# EAGLE board dw08aRev3 (EAGLE 6.6.0), part 1 of 3
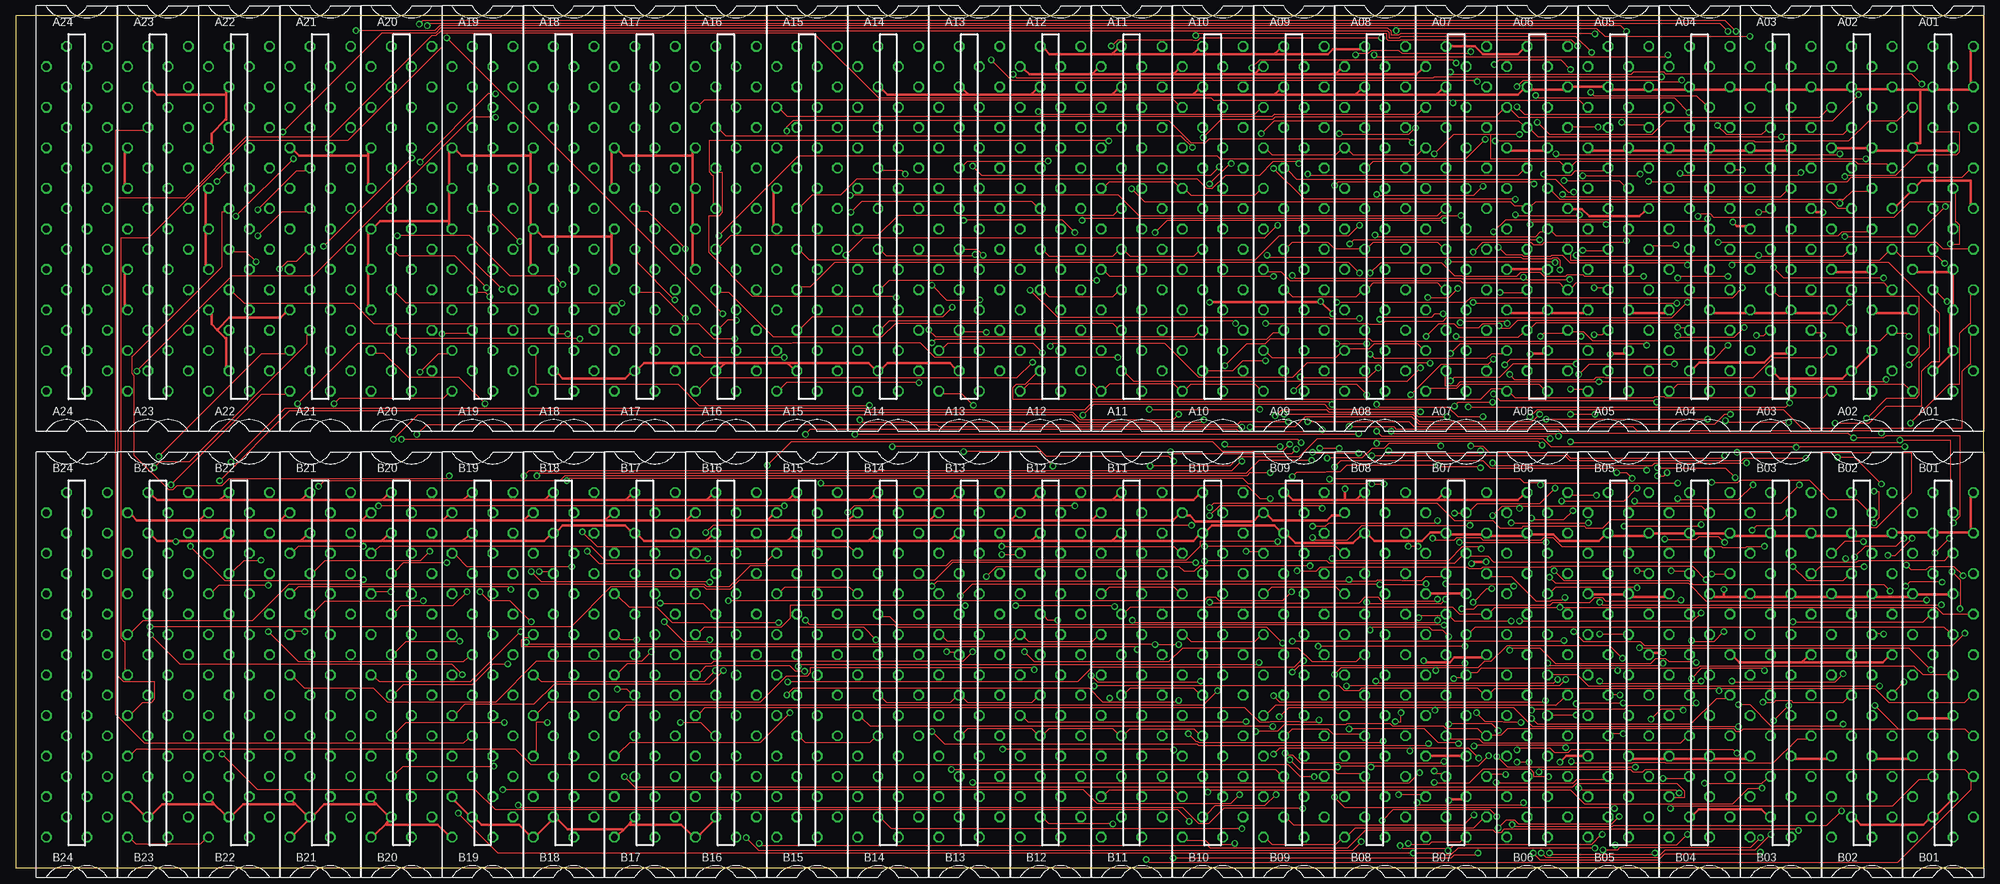
[diagram p6: board, top side]
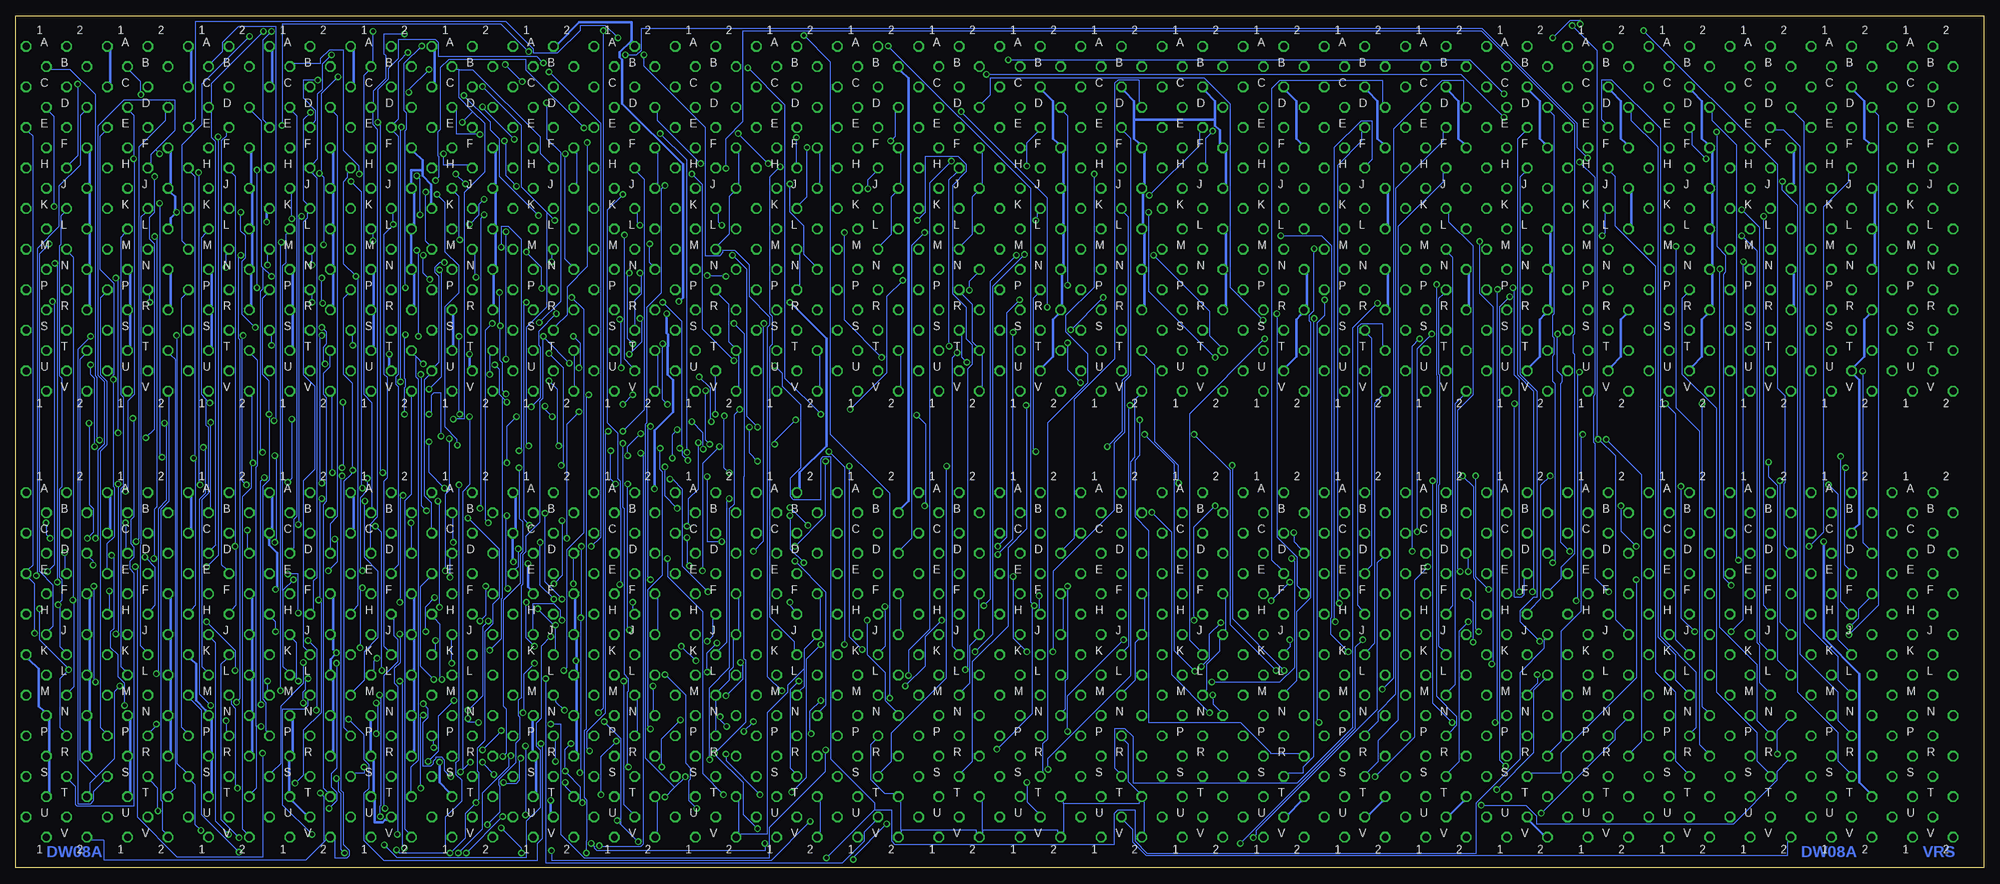
[diagram p7: board, bottom side, seen from below]

Size 307.98 x 133.35 mm. Coordinates in mm from the lower left corner, seen from the top.
Outline: 0,0 307.98,0 307.98,133.35 0,133.35 0,0
Copper layers (1*16): Top 0.035mm / dielectric 1.5mm / Bottom 0.035mm
Design rules "sierraproto": minimum track width 6mil, minimum drill 24mil, track to track 6mil, track to pad 6mil, pad to pad 10mil, via to via 6mil, smd to smd 6mil, copper to edge 25mil, drill to drill 10mil, minimum pad ring 10mil, minimum via ring 8mil, stop-mask expansion 0mil, vias tented up to drill 0mil, thermal gap 10mil
Net classes: 1 supply: width 0.381 mm

## Footprints (pad centres in the part's own frame; a part is rotated, then mirrored left to right if it is on the bottom)
H807 = drill 1.092 octagon: A1 4.763,28.575; A2 -1.587,28.575; B1 1.587,25.4; B2 -4.763,25.4; C1 4.763,22.225; C2 -1.587,22.225; D1 1.587,19.05; D2 -4.763,19.05; E1 4.763,15.875; E2 -1.587,15.875; F1 1.587,12.7; F2 -4.763,12.7; H1 4.763,9.525; H2 -1.587,9.525; J1 1.587,6.35; J2 -4.763,6.35; K1 4.763,3.175; K2 -1.587,3.175; L1 1.587,0; L2 -4.763,0; M1 4.763,-3.175; M2 -1.587,-3.175; N1 1.587,-6.35; N2 -4.763,-6.35; P1 4.763,-9.525; P2 -1.587,-9.525; R1 1.587,-12.7; R2 -4.763,-12.7; S1 4.763,-15.875; S2 -1.587,-15.875; T1 1.587,-19.05; T2 -4.763,-19.05; U1 4.763,-22.225; U2 -1.587,-22.225; V1 1.587,-25.4; V2 -4.763,-25.4

## Placement (x,y rotation side)
A01  M903  [H807]  301.62,100.01 0 top
A02  M903  [H807]  288.93,100.01 0 top
A03  M903  [H807]  276.23,100.01 0 top
A04  M903  [H807]  263.52,100.01 0 top
A05  M903  [H807]  250.82,100.01 0 top
A06  M907  [H807]  238.12,100.01 0 top
A07  M651  [H807]  225.43,100.01 0 top
A08  M651  [H807]  212.72,100.01 0 top
A09  M651  [H807]  200.03,100.01 0 top
A10  M651  [H807]  187.32,100.01 0 top
A11  M651  [H807]  174.62,100.01 0 top
A12  M651  [H807]  161.93,100.01 0 top
A13  W011  [H807]  149.22,100.01 0 top
A14  W011  [H807]  136.53,100.01 0 top
A15  W011  [H807]  123.83,100.01 0 top
A16  W011  [H807]  111.12,100.01 0 top
A17  W011  [H807]  98.42,100.01 0 top
A18  W011  [H807]  85.72,100.01 0 top
A19  W011  [H807]  73.03,100.01 0 top
A20  W011  [H807]  60.33,100.01 0 top
A21  W011  [H807]  47.62,100.01 0 top
A22  W011  [H807]  34.92,100.01 0 top
A23  W011  [H807]  22.23,100.01 0 top
A24  H807  [H807]  9.53,100.01 0 top
B01  M903  [H807]  301.62,30.16 0 top
B02  M903  [H807]  288.93,30.16 0 top
B03  M903  [H807]  276.23,30.16 0 top
B04  M903  [H807]  263.52,30.16 0 top
B05  M903  [H807]  250.82,30.16 0 top
B06  M101  [H807]  238.12,30.16 0 top
B07  M907  [H807]  225.43,30.16 0 top
B08  M651  [H807]  212.72,30.16 0 top
B09  M651  [H807]  200.03,30.16 0 top
B10  M651  [H807]  187.32,30.16 0 top
B11  M651  [H807]  174.62,30.16 0 top
B12  M651  [H807]  161.93,30.16 0 top
B13  M651  [H807]  149.22,30.16 0 top
B14  M651  [H807]  136.53,30.16 0 top
B15  M651  [H807]  123.83,30.16 0 top
B16  M517  [H807]  111.12,30.16 0 top
B17  M517  [H807]  98.42,30.16 0 top
B18  M517  [H807]  85.72,30.16 0 top
B19  M517  [H807]  73.03,30.16 0 top
B20  M517  [H807]  60.33,30.16 0 top
B21  M517  [H807]  47.62,30.16 0 top
B22  M517  [H807]  34.92,30.16 0 top
B23  M517  [H807]  22.23,30.16 0 top
B24  H807  [H807]  9.53,30.16 0 top

## Tracks (layer width: path | path; a pad name or v marks a point on that pad's centre or on a via)
!I_MB03  (via drill 0.61)
  Top 0.152: A08.H2 211.84,109.98 212.47,110.62 241.55,110.62 242.19,109.98 A06.H1 243.59,109.98 244.22,110.62 287.91,110.62 288.29,110.24 292.74,110.24 292.99,109.98 A02.H1 | v293.37,43.31 292.35,44.32 262.51,44.32 261.87,44.96 242.32,44.96 v240.79,46.48 | v240.16,67.18 239.78,67.56 213.74,67.56 v212.98,68.33
  Bottom 0.152: v293.37,43.31 293.37,40.39 B02.H1 | v240.79,46.48 240.79,58.42 240.16,59.05 v240.16,67.18 | v212.98,68.33 209.55,71.75 209.55,107.7 210.69,108.84 A08.H2
!I_MB04  (via drill 0.61)
  Top 0.152: v212.72,99.06 212.98,98.81 237.87,98.81 238.63,99.57 239.01,99.57 A06.L1 240.41,99.57 241.05,98.93 285.24,98.93 285.88,99.57 289.81,99.57 A02.L1
  Bottom 0.152: v212.72,99.06 212.72,79.63 211.58,78.49 A08.U2 | B02.L1 290.96,30.86 291.59,31.5 291.59,59.31 291.21,59.69 291.21,73.66 291.59,74.04 291.59,98.68 290.96,99.31 A02.L1
!I_MB05
  Top 0.152: A09.N2 195.96,93.34 197.99,93.34 199.39,91.95 226.06,91.95 226.44,91.57 241.55,91.57 242.19,90.93 A06.P1 243.59,90.93 244.22,91.57 292.35,91.57 292.99,90.93 A02.P1
  Bottom 0.152: B02.P1 294.13,21.34 294.77,21.97 294.77,65.15 293.75,66.17 293.75,76.2 294.77,77.22 294.77,89.15 294.13,89.79 A02.P1
!I_MB06  (via drill 0.61)
  Top 0.152: v185.8,114.3 188.72,117.22 196.72,117.22 197.1,117.6 231.65,117.6 232.66,118.62 A06.D2 234.06,118.62 235.2,117.47 282.32,117.47 283.46,118.62 A02.D2 | v289.18,51.05 286.26,51.05 284.86,49.66 B02.D2
  Bottom 0.152: v185.8,114.3 185.8,110.24 A10.H2 | v289.18,51.05 288.8,51.44 288.8,112.78 284.61,116.97 284.61,118.36 A02.D2
!I_MB07  (via drill 0.61)
  Top 0.152: v195.58,79.38 192.02,79.38 190.5,77.85 186.44,77.85 A10.U2 | v202.18,108.58 202.31,108.46 235.2,108.46 235.84,109.09 A06.H2 | v287.78,48.64 289.43,50.29 294.26,50.29 v295.53,51.56 | v241.05,111.76 241.17,111.63 285.37,111.63 v285.5,111.76
  Bottom 0.152: v195.58,79.38 200.53,84.33 200.53,106.93 v202.18,108.58 | v287.78,48.64 286.26,47.12 286.26,41.02 286.89,40.39 B02.H2 | v295.53,51.56 295.15,51.94 295.15,65.28 294.13,66.29 294.13,76.07 295.15,77.09 295.15,116.08 291.08,120.14 283.08,120.14 283.08,115.44 286.13,112.39 | 286.13,112.39 286.89,111.63 286.89,110.24 A02.H2 | v241.05,111.76 241.05,109.98 237.24,109.98 A06.H2 | v285.5,111.76 286.13,112.39
!I_MB08  (via drill 0.61)
  Top 0.152: v196.85,92.58 171.2,92.58 170.56,93.22 A11.N2 | v199.77,92.71 200.15,92.33 226.19,92.33 226.31,92.2 235.71,92.2 v235.97,92.46 236.35,92.2 236.47,92.08 v243.21,92.08 | v273.43,25.91 275.21,25.91 275.46,26.16 277.88,26.16 278.13,25.91 286,25.91 286.64,26.54 B02.M2 | A02.M2 286.64,96.39 286,95.76 272.92,95.76 v272.8,95.89 272.42,95.76 244.35,95.76 v244.22,95.89
  Bottom 0.152: v196.85,92.58 199.77,92.58 v199.77,92.71 | v235.97,92.46 236.09,92.58 236.09,96.14 A06.M2 | v273.43,25.91 272.92,26.42 272.92,82.68 273.18,82.93 273.18,95.5 v272.8,95.89 | v243.21,92.08 244.22,93.09 v244.22,95.89
!O_MB03  (via drill 0.61)
  Top 0.152: v200.79,110.24 200.41,110.62 196.85,110.62 194.69,108.46 189.36,108.46 187.2,106.3 186.44,106.3 184.91,107.82 131.57,107.82 129.03,105.28 124.59,105.28 122.94,103.63 A15.K2
  Bottom 0.152: v200.79,110.24 207.52,116.97 207.52,118.36 A08.D2
!O_MB04  (via drill 0.61)
  Top 0.152: v210.31,93.09 208.66,94.74 128.14,94.74 124.33,90.93 122.94,90.93 A15.P2
  Bottom 0.152: v210.31,93.09 210.06,92.84 210.06,89.92 211.07,88.9 211.07,84.84 A08.S2
!O_MB05  (via drill 0.61)
  Top 0.152: v129.92,95.89 132.59,98.55 195.45,98.55 v197.49,100.58
  Bottom 0.152: v129.92,95.89 121.16,87.12 121.16,83.31 119.51,81.66 A15.T2 | v197.49,100.58 197.99,101.09 197.99,102.49 A09.K2
!O_MB06
  Top 0.152: A16.D2 107.06,119.51 107.7,120.14 181.23,120.14 181.86,119.51 A10.D2
!O_MB07  (via drill 0.61)
  Top 0.152: v142.88,84.2 144.02,83.06 184.4,83.06 185.04,83.69 A10.S2 | v137.79,89.28 137.67,89.41 115.32,89.41 108.46,96.27 108.46,102.11 110.11,102.11 110.62,102.62 110.62,108.84 109.98,108.84 A16.H2
  Bottom 0.152: v142.88,84.2 v137.79,89.28
!O_MB08
  Top 0.152: A16.M2 110.24,97.28 111.89,98.93 134.87,98.93 138.05,102.11 171.7,102.11 172.34,102.74 A11.K2
-15V
  Top 0.381: 168.53,124.33 169.16,124.97 A11.B2 | 168.53,124.33 168.4,124.21 158.62,124.21 157.86,124.97 A12.B2 | 181.23,124.33 181.1,124.21 168.66,124.21 168.53,124.33 | 181.23,124.33 181.86,124.97 A10.B2 | 193.93,124.33 193.8,124.21 181.36,124.21 181.23,124.33 | 193.93,124.33 194.56,124.97 A09.B2 | 206.63,124.33 206.5,124.21 194.06,124.21 193.93,124.33 | 206.63,124.33 207.26,124.97 A08.B2 | A07.B2 219.96,124.97 219.2,124.21 206.76,124.21 206.63,124.33 | B08.B2 207.26,55.12 205.99,55.12 205.23,54.36 196.72,54.36 195.96,55.12 B09.B2 194.56,55.12 193.68,54.23 184.66,54.23 183.77,55.12 183.26,55.12 B10.B2 181.86,55.12 181.1,54.36 168.66,54.36 168.53,54.48 | 28.83,54.48 29.46,55.12 B22.B2 | 28.83,54.48 28.7,54.36 18.92,54.36 18.16,55.12 B23.B2 | 41.53,54.48 41.4,54.36 28.96,54.36 28.83,54.48 | 41.53,54.48 42.16,55.12 B21.B2 | 54.23,54.48 54.1,54.36 41.66,54.36 41.53,54.48 | 54.23,54.48 54.86,55.12 B20.B2 | 66.93,54.48 66.8,54.36 54.36,54.36 54.23,54.48 | 66.93,54.48 67.56,55.12 B19.B2 | 79.63,54.48 79.5,54.36 67.06,54.36 66.93,54.48 | 79.63,54.48 80.26,55.12 B18.B2 | 92.33,54.48 92.2,54.36 79.76,54.36 79.63,54.48 | 92.33,54.48 92.96,55.12 B17.B2 | 105.03,54.48 104.9,54.36 92.46,54.36 92.33,54.48 | 105.03,54.48 105.66,55.12 B16.B2 | 117.73,54.48 117.6,54.36 105.16,54.36 105.03,54.48 | 117.73,54.48 118.36,55.12 B15.B2 | 130.43,54.48 130.3,54.36 117.86,54.36 117.73,54.48 | 130.43,54.48 131.06,55.12 B14.B2 | 143.13,54.48 143,54.36 130.56,54.36 130.43,54.48 | 143.13,54.48 143.76,55.12 B13.B2 | 155.83,54.48 155.7,54.36 143.26,54.36 143.13,54.48 | 155.83,54.48 156.46,55.12 B12.B2 | 168.53,54.48 168.4,54.36 155.96,54.36 155.83,54.48
  Top 0.381: 168.53,54.48 169.16,55.12 B11.B2
  Bottom 0.381: A11.B2 169.42,124.71 168.28,123.57 168.28,57.4 169.42,56.26 B11.B2
A06U1  (via drill 0.61)
  Top 0.152: A10.M2 185.04,96.39 184.4,95.76 174.37,95.76 173.74,96.39 A11.M2 172.34,96.39 171.7,95.76 161.67,95.76 161.04,96.39 A12.M2 | A07.M2 223.14,97.28 222.5,97.92 212.47,97.92 211.84,97.28 A08.M2 210.44,96.9 206.38,96.9 205.36,97.92 199.77,97.92 199.14,97.28 A09.M2 | A09.J2 194.56,105.92 193.93,105.28 183.9,105.28 183.26,105.92 A10.J2 181.86,106.81 181.23,107.44 171.2,107.44 170.56,106.81 A11.J2 | A09.F2 195.96,112.27 196.6,111.63 206.63,111.63 207.26,112.27 A08.F2 208.66,112.27 209.3,111.63 219.33,111.63 219.96,112.27 A07.F2 | v240.92,94.74 240.79,94.87 v224.16,94.87
  Bottom 0.152: A12.M2 159.89,97.54 158.24,99.19 158.24,105.03 157.61,105.66 A12.J2 156.72,107.06 156.72,112.01 A12.F2 | A10.P2 185.29,91.19 185.29,96.14 A10.M2 | A11.M2 172.59,97.54 170.94,99.19 170.94,105.03 170.31,105.66 A11.J2 169.42,107.06 169.42,112.01 A11.F2 | B06.C1 242.95,53.09 242.95,57.15 244.09,58.29 244.09,76.33 243.33,77.09 A06.U1 242.44,78.49 241.81,79.12 241.81,92.58 242.44,93.22 242.44,93.98 241.68,94.74 v240.92,94.74 | A07.J2 220.22,107.06 220.22,112.01 A07.F2 | A08.J2 207.52,107.06 207.52,112.01 A08.F2 | A10.J2 182.12,107.06 182.12,112.01 A10.F2 | A09.M2 197.99,97.54 196.34,99.19 196.34,105.03 195.71,105.66 A09.J2 194.82,107.06 194.82,112.01 A09.F2 | v224.16,94.87 224.16,96.14 A07.M2
A06V1
  Top 0.152: A11.P2 172.34,90.04 171.7,89.41 161.67,89.41 161.04,90.04 A12.P2 | A12.V2 157.86,75.06 158.5,75.69 168.53,75.69 169.16,75.06 A11.V2 170.56,75.06 171.2,75.69 181.23,75.69 181.86,75.06 A10.V2 183.26,75.06 183.9,75.69 193.93,75.69 194.56,75.06 A09.V2 | A06.V1 239.01,75.06 238.38,75.69 226.19,75.69 225.55,75.06 221.36,75.06 A07.V2 | A09.P2 199.14,90.04 199.77,89.41 209.8,89.41 210.44,90.04 A08.P2 211.84,90.93 212.47,91.57 222.5,91.57 223.14,90.93 A07.P2 | A09.T2 195.96,80.52 196.6,79.88 206.63,79.88 207.26,80.52 A08.T2 208.66,81.28 211.84,81.28 212.6,82.04 219.33,82.04 219.96,81.41 A07.T2
  Bottom 0.152: A10.V2 182.12,75.31 182.12,80.26 A10.T2 | A11.V2 169.42,75.31 169.42,80.26 A11.T2 | A12.V2 156.72,75.31 156.72,80.26 A12.T2 157.61,81.66 158.24,82.3 158.24,88.14 159.89,89.79 A12.P2 | A07.V2 220.6,75.31 220.6,80.26 A07.T2 | A08.V2 207.52,75.31 207.52,80.26 A08.T2 | A09.V2 194.82,75.31 194.82,80.26 A09.T2 195.71,81.66 196.34,82.3 196.34,88.14 197.99,89.79 A09.P2
B07U1
  Top 0.152: B14.M2 135.64,26.54 136.27,25.91 146.3,25.91 146.94,26.54 B13.M2 148.34,26.54 148.97,25.91 159,25.91 159.64,26.54 B12.M2 | B15.F2 119.76,43.31 120.4,43.94 130.43,43.94 131.06,43.31 B14.F2 | B13.J2 145.16,36.07 145.8,35.43 155.83,35.43 156.46,36.07 B12.J2 157.86,36.07 158.5,35.43 168.53,35.43 169.16,36.07 B11.J2 | B07.U1 229.49,7.49 228.22,6.22 209.68,6.22 208.66,5.21 B08.V2 207.26,4.32 206.63,3.68 196.6,3.68 195.96,4.32 B09.V2 | B11.M2 173.74,27.43 174.37,28.07 184.4,28.07 185.04,27.43 B10.M2 | B08.P2 210.44,20.95 206.12,20.95 205.36,21.72 199.77,21.72 199.14,21.08 B09.P2 | B08.F2 207.26,43.31 206.63,43.94 196.6,43.94 195.96,43.31 B09.F2 | B10.J2 183.26,36.07 183.9,35.43 193.93,35.43 194.56,36.07 B09.J2 | B11.F2 170.56,43.31 171.2,43.94 181.23,43.94 181.86,43.31 B10.F2
  Bottom 0.152: B15.M2 121.79,27.69 121.54,27.94 121.54,31.88 119.51,33.91 119.51,35.81 B15.J2 118.62,37.21 118.62,42.16 B15.F2 | B14.M2 134.49,27.69 132.84,29.34 132.84,35.18 132.21,35.81 B14.J2 131.32,37.21 131.32,42.16 B14.F2 | B11.J2 169.42,37.21 169.42,42.16 B11.F2 | B13.J2 144.02,37.21 144.02,42.16 B13.F2 | B12.M2 159.89,27.69 158.62,28.96 158.62,34.8 157.61,35.81 B12.J2 157.23,37.21 157.23,42.16 B12.F2 | B09.T2 194.82,10.41 194.82,5.46 B09.V2 194.56,5.21 190.37,5.21 190.37,24.26 187.2,27.43 187.2,28.57 184.66,31.11 | B08.V2 207.52,5.46 207.52,10.41 B08.T2 | B10.F2 182.12,42.16 182.12,37.21 B10.J2 183.01,35.81 184.66,34.16 184.66,31.11 | 184.66,31.11 184.66,28.32 185.29,27.69 B10.M2 | B08.J2 207.52,37.21 207.52,42.16 B08.F2 | B08.P2 210.69,21.34 210.69,26.29 B08.M2 | B09.P2 198.5,21.34 198.5,26.29 B09.M2 197.99,27.69 196.34,29.34 196.34,30.73 195.71,31.37 195.71,35.81 B09.J2 194.82,37.21 194.82,42.16 B09.F2
B07V1  (via drill 0.61)
  Top 0.152: v217.93,3.81 218.06,3.68 221.23,3.68 221.62,4.06 226.06,4.06 226.31,4.32 B07.V1 | v190.75,3.81 190.63,3.68 186.82,3.68 186.18,4.32 183.26,4.32 B10.V2 | B13.P2 148.34,21.08 148.97,21.72 159,21.72 159.64,21.08 B12.P2 161.04,21.08 161.67,21.72 171.7,21.72 172.34,21.08 B11.P2 173.74,21.08 174.37,21.72 184.4,21.72 185.04,21.08 B10.P2 | B15.P2 122.94,20.19 123.57,19.56 133.6,19.56 134.24,20.19 B14.P2 | B10.T2 181.86,11.56 181.23,12.19 171.2,12.19 170.56,11.56 B11.T2
  Bottom 0.152: B10.V2 182.12,5.46 182.12,10.41 B10.T2 | v217.93,3.81 217.42,3.3 217.42,3.05 217.04,2.67 190.75,2.67 v190.75,3.81 | 169.42,5.84 169.42,10.41 B11.T2 170.56,11.56 171.96,11.56 174.12,13.72 174.12,19.3 173.48,19.94 B11.P2 | 169.42,5.84 169.42,5.46 B11.V2 | 156.72,5.84 156.72,10.41 B12.T2 | 156.72,5.84 156.72,5.46 B12.V2 157.61,5.46 157.61,5.84 169.42,5.84 | 144.02,10.03 144.02,10.41 B13.T2 | 144.02,10.03 144.02,5.46 B13.V2 144.91,5.46 144.91,5.84 156.72,5.84 | B14.V2 131.32,5.46 131.32,10.41 B14.T2 | B14.T2 132.21,11.81 133.86,13.46 133.86,19.3 134.49,19.94 B14.P2 | 144.02,10.03 132.21,10.03 132.21,10.41 B14.T2
GND  (via drill 0.61)
  Top 0.381: A23.N2 17.02,92.96 17.02,88.01 A23.R2 | A23.F2 17.02,112.01 17.02,107.06 A23.J2 | 31.5,84.2 30.61,85.09 30.61,86.61 A22.R2 | 31.5,84.2 32.77,82.93 32.89,82.93 32.89,78.49 A22.U2 | A22.N2 29.72,94.36 29.72,99.31 A22.L2 29.72,100.71 29.72,105.66 A22.J2 | 32.89,121.03 32.89,117.09 32.77,117.09 30.61,114.94 30.61,113.41 A22.F2 | 32.89,121.03 32.89,121.54 A22.C2 | A23.C2 21.34,121.79 22.1,121.03 32.77,121.03 32.89,121.03 | A20.R2 55.12,88.01 55.12,92.96 A20.N2 55.12,94.36 55.12,99.31 A20.L2 56.26,100.46 57.02,101.22 67.69,101.22 67.82,101.22 | 55.12,111.51 55.12,107.06 A20.J2 | 55.12,111.51 55.12,112.01 A20.F2 | A21.F2 43.56,112.27 44.32,111.51 54.99,111.51 55.12,111.51 | 31.5,84.2 31.62,84.33 33.4,86.11 41.4,86.11 42.16,86.87 A21.R2 | 67.82,101.22 67.82,100.71 A19.L2 | 67.82,101.22 67.82,105.66 A19.J2 67.82,107.06 67.82,112.01 A19.F2 68.96,112.27 69.72,111.51 80.39,111.51 80.52,111.51 | A18.L2 80.52,99.31 80.52,94.36 A18.N2 | A18.L2 80.52,100.71 80.52,105.66 A18.J2 80.52,107.06 80.52,111.51 | 80.52,111.51 80.52,112.01 A18.F2 | 93.22,98.81 93.22,94.36 A17.N2 | 93.22,98.81 93.22,99.31 A17.L2 | A17.J2 93.22,107.06 93.22,112.01 A17.F2 94.36,112.27 95.12,111.51 105.79,111.51 105.92,111.51 | A18.L2 81.66,99.57 82.42,98.81 93.09,98.81 93.22,98.81 | A18.U2 84.84,77.34 85.6,76.58 95.38,76.58 96.14,77.34 A17.U2 97.54,78.23 98.3,78.99 110.74,78.99 110.87,78.87 | 120.9,78.87 120.78,78.99 111,78.99 110.87,78.87 | 120.9,78.87 121.54,78.23 A15.U2 | 110.87,78.87 110.24,78.23 A16.U2 | A16.N2 105.92,94.36 105.92,99.31 A16.L2 105.92,100.71 105.92,105.66 A16.J2 105.92,107.06 105.92,111.51
  Top 0.381: 105.92,111.51 105.92,112.01 A16.F2 | 120.9,78.87 121.03,78.99 133.48,78.99 134.24,78.23 A14.U2 135.64,78.23 136.4,78.99 146.18,78.99 146.94,78.23 A13.U2 | 298.07,121.79 299.34,121.79 A01.C2 300.74,121.79 305.69,121.79 A01.C1 305.94,122.94 305.94,127.89 A01.A1 | 298.07,121.79 294.39,121.79 A02.C1 292.99,121.92 288.04,121.92 A02.C2 286.64,121.79 281.69,121.79 A03.C1 280.29,121.79 275.34,121.79 A03.C2 273.94,121.79 268.99,121.79 A04.C1 267.59,121.79 262.64,121.79 A04.C2 261.24,121.79 256.29,121.79 A05.C1 254.89,121.79 249.94,121.79 A05.C2 248.54,122.3 243.59,122.3 A06.C1 242.19,121.79 237.24,121.79 A06.C2 235.84,121.79 235.08,121.03 222.63,121.03 222.5,121.16 | A05.K1 254.89,102.74 254.13,101.98 246.25,101.98 245.11,103.12 243.59,103.12 A06.K1 | A05.F2 246.76,112.27 251.71,112.27 A05.F1 253.11,112.27 258.06,112.27 A04.F2 259.46,112.27 264.41,112.27 A04.F1 265.81,112.27 270.76,112.27 A03.F2 272.16,112.27 277.11,112.27 A03.F1 | v236.98,80.39 237.11,80.52 239.01,80.52 A06.T1 | A06.R2 234.06,86.87 239.01,86.87 A06.R1 240.41,86.87 245.36,86.87 A05.R2 | A06.N1 239.01,93.73 234.06,93.73 A06.N2 | A06.F1 239.01,112.27 234.06,112.27 A06.F2 | v249.56,80.39 249.68,80.52 251.71,80.52 A05.T1 | A04.R2 258.06,86.87 253.11,86.87 A05.R1 | A04.R1 265.81,86.87 270.76,86.87 A03.R2 272.16,86.87 277.11,86.87 A03.R1 278.51,86.87 283.46,86.87 A02.R2 | v268.73,101.09 269.37,100.46 270.76,100.46 A03.L2 | A04.U2 262.64,78.23 263.52,79.12 273.69,79.12 275.08,80.52 277.11,80.52 A03.T1 | A01.F2 296.16,112.27 291.21,112.27 A02.F1 289.81,112.65 284.86,112.65 A02.F2
  Top 0.381: A01.F1 302.51,112.27 297.56,112.27 A01.F2 | v282.83,102.62 281.81,102.62 281.69,102.74 A03.K1 | A01.U2 300.74,78.23 302.77,80.26 A01.T1 302.77,81.66 302.77,86.61 A01.R1 303.15,88.01 303.15,92.96 A01.N1 302.51,93.22 297.56,93.22 A01.N2 | A02.K1 294.39,103.63 296.42,105.66 A01.J2 297.56,106.81 298.32,107.57 305.94,107.57 305.94,103.89 A01.K1 | A03.U2 275.34,77.34 276.1,76.58 285.88,76.58 286.64,77.34 A02.U2 288.04,78.23 290.07,80.26 A02.T1 | A01.R2 296.16,86.87 291.21,86.87 A02.R1 | A02.N2 284.86,93.22 289.81,93.22 A02.N1 | 298.07,121.79 298.07,121.67 298.07,113.41 297.31,113.41 A01.F2 | A15.J2 118.62,105.66 118.62,100.71 A15.L2 | 159,121.16 158.88,121.03 149.1,121.03 148.97,121.16 | 159,121.16 159.64,121.79 A12.C2 | 148.97,121.16 148.34,121.79 A13.C2 | 171.7,121.16 171.58,121.03 159.13,121.03 159,121.16 | 171.7,121.16 172.34,121.79 A11.C2 | 184.4,121.16 184.28,121.03 171.83,121.03 171.7,121.16 | 184.4,121.16 185.04,121.79 A10.C2 | 197.1,121.16 196.98,121.03 184.53,121.03 184.4,121.16 | 197.1,121.16 197.74,121.79 A09.C2 | 209.8,121.16 209.68,121.03 197.23,121.03 197.1,121.16 | 209.8,121.16 210.44,121.79 A08.C2 | 222.5,121.16 222.38,121.03 209.93,121.03 209.8,121.16 | 222.5,121.16 223.14,121.79 A07.C2 | A14.C2 135.64,121.79 136.4,121.03 148.84,121.03 148.97,121.16 | B02.U2 288.04,7.49 288.8,6.73 298.58,6.73 299.34,7.49 B01.U2 300.74,8.38 302.77,10.41 B01.T1 | B01.R2 296.16,17.02 291.21,17.02 B02.R1 | B01.F1 302.51,42.8 297.56,42.8 B01.F2 296.16,42.42 291.21,42.42 B02.F1 289.81,42.42 284.86,42.42 B02.F2 283.46,42.42 278.51,42.42 B03.F1 277.11,42.42 272.16,42.42 B03.F2 270.76,42.42 267.33,42.42
  Top 0.381: B01.N1 302.51,23.37 297.56,23.37 B01.N2 | v257.81,33.66 256.29,33.66 B05.K1 | B05.R1 253.11,17.02 258.06,17.02 B04.R2 259.46,17.02 264.41,17.02 B04.R1 265.81,17.02 270.76,17.02 B03.R2 | B04.F2 258.06,42.42 253.11,42.42 B05.F1 251.71,42.8 246.76,42.8 B05.F2 | v241.68,16.51 242.7,17.53 245.36,17.53 B05.R2 | B03.U2 273.94,8.38 273.18,9.14 263.4,9.14 262.64,8.38 B04.U2 | 279.65,32.26 280.29,32.89 B03.K1 | 279.65,32.26 279.53,32.13 269.75,32.13 268.99,32.89 B04.K1 | B02.K1 292.99,32.89 292.23,32.13 279.78,32.13 279.65,32.26 | 267.33,42.42 265.81,42.42 B04.F1 | B02.R2 283.46,17.02 278.51,17.02 B03.R1 | B16.U2 109.09,7.24 107.06,5.21 B16.V2 105.66,5.21 104.14,6.73 96.14,6.73 96.01,6.86 | 96.01,6.86 96.39,7.24 B17.U2 | 95,5.84 96.01,6.86 | 95,5.84 94.36,5.21 B17.V2 | 95,5.84 94.87,5.97 86.36,5.97 84.84,7.49 B18.U2 83.69,7.24 81.66,5.21 B18.V2 80.26,5.21 78.74,6.73 72.9,6.73 72.14,7.49 B19.U2 70.74,8.38 68.71,10.41 B19.T2 | B23.T2 17.91,10.41 19.94,8.38 B23.U2 21.34,8.38 22.86,9.91 30.86,9.91 30.99,10.03 | 30.99,10.03 32.64,8.38 B22.U2 34.04,8.38 35.56,9.91 43.56,9.91 43.69,10.03 | 30.99,10.03 30.61,10.41 B22.T2 | B21.V2 43.56,5.21 45.59,7.24 B21.U2 | 43.69,10.03 45.34,8.38 B21.U2 | 43.69,10.03 43.31,10.41 B21.T2 | 57.91,6.86 58.29,7.24 B20.U2 58.04,8.38 56.39,10.03 | 57.91,6.86 56.26,5.21 B20.V2 | 56.39,10.03 56.01,10.41 B20.T2 | B21.U2 46.74,8.38 48.26,9.91 56.26,9.91 56.39,10.03 | B19.V2 67.56,5.21 66.04,6.73 58.04,6.73 57.91,6.86 | B01.A1 305.94,58.04 305.94,53.09 B01.C1 305.69,52.45 300.74,52.45 B01.C2 299.34,52.45 294.39,52.45 B02.C1 292.99,51.94 288.04,51.94 B02.C2 286.64,51.94 281.69,51.94 B03.C1 280.29,51.94 275.34,51.94 B03.C2 273.94,51.94 268.99,51.94 B04.C1 267.59,52.32 262.64,52.32 B04.C2 261.24,52.32 256.29,52.32 B05.C1 254.89,51.94 249.94,51.94 B05.C2 248.54,51.94 247.78,51.18 241.68,51.18 240.66,52.2 237.24,52.2 B06.C2 235.84,51.94 230.89,51.94 B07.C1 229.49,52.2 224.54,52.2 B07.C2 223.14,52.45 221.36,52.45 220.09,51.18 212.6,51.18 211.84,51.94 B08.C2 210.44,51.94 209.3,50.8 200.28,50.8 199.14,51.94 B09.C2 197.74,52.83 196.98,53.59 187.2,53.59 186.44,52.83 B10.C2 185.04,51.94 184.28,51.18 171.83,51.18 171.7,51.31
  Top 0.381: 25.02,51.18 31.88,51.18 32,51.31 | 25.02,51.18 22.1,51.18 21.34,51.94 B23.C2 | 32,51.31 32.64,51.94 B22.C2 | 44.7,51.31 44.58,51.18 32.13,51.18 32,51.31 | 44.7,51.31 45.34,51.94 B21.C2 | 57.4,51.31 57.28,51.18 44.83,51.18 44.7,51.31 | 57.4,51.31 58.04,51.94 B20.C2 | 70.1,51.31 69.98,51.18 57.53,51.18 57.4,51.31 | 70.1,51.31 70.74,51.94 B19.C2 | 70.1,51.31 70.23,51.18 82.68,51.18 83.44,51.94 B18.C2 84.84,52.83 85.6,53.59 95.38,53.59 96.14,52.83 B17.C2 97.54,51.94 98.3,51.18 108.08,51.18 108.2,51.31 | v224.28,10.54 224.41,10.67 226.31,10.67 B07.T1 | B07.R2 221.36,17.53 226.31,17.53 B07.R1 | B07.F1 226.31,42.93 221.36,42.93 B07.F2 | v220.34,32.38 220.6,32.13 224.41,32.13 225.17,32.89 229.49,32.89 B07.K1 | 108.2,51.31 108.84,51.94 B16.C2 | 120.9,51.31 120.78,51.18 108.33,51.18 108.2,51.31 | 120.9,51.31 121.54,51.94 B15.C2 | 133.6,51.31 133.48,51.18 121.03,51.18 120.9,51.31 | 133.6,51.31 134.24,51.94 B14.C2 | 146.3,51.31 146.18,51.18 133.73,51.18 133.6,51.31 | 146.3,51.31 146.94,51.94 B13.C2 | 159,51.31 158.88,51.18 146.43,51.18 146.3,51.31 | 159,51.31 159.64,51.94 B12.C2 | 171.7,51.31 171.58,51.18 159.13,51.18 159,51.31 | 171.7,51.31 172.34,51.94 B11.C2 | v227.84,47.62 228.09,47.88 v230.12,47.88 | 25.02,51.18 v25.02,51.05 | v267.33,43.56 267.33,42.55 267.33,42.42
  Bottom 0.381: A23.R2 17.91,86.61 18.67,85.85 18.67,80.01 20.19,78.49 A23.U2 20.19,77.09 19.43,76.33 19.43,53.85 20.19,53.09 B23.C2 | A23.N2 17.02,94.36 17.02,99.31 A23.L2 17.02,100.71 17.02,105.66 A23.J2 | A23.C2 20.19,121.54 18.67,120.02 18.67,114.17 17.91,113.41 A23.F2 | A22.N2 29.72,92.96 29.72,88.01 A22.R2 | A22.F2 29.72,112.01 29.72,107.06 A22.J2 | A21.U2 45.59,78.49 44.07,80.01 44.07,85.85 43.31,86.61 A21.R2 42.42,88.01 42.42,92.96 A21.N2 42.42,94.36 42.42,99.31 A21.L2 42.42,100.71 42.42,105.66 A21.J2 42.42,107.06 42.42,112.01 A21.F2 43.31,113.41 44.07,114.17 44.07,120.02 45.59,121.54 A21.C2 | A20.U2 58.29,78.49 56.77,80.01 56.77,85.85 56.01,86.61 A20.R2 | A20.J2 55.12,105.66 55.12,100.71 A20.L2 | A20.C2 58.29,121.54 56.77,120.02 56.77,114.17 56.01,113.41 A20.F2 | A19.U2 70.99,78.49 69.47,80.01 69.47,85.85 68.71,86.61 A19.R2 67.82,88.01 67.82,92.96 A19.N2 67.82,94.36 67.82,99.31 A19.L2 | A19.C2 70.99,121.54 69.47,120.02 69.47,114.17 68.71,113.41 A19.F2 | A18.R2 80.52,88.01 80.52,92.96 A18.N2 | A18.C2 83.69,121.54 82.17,120.02 82.17,114.17 81.41,113.41 A18.F2 | A17.R2 93.22,88.01 93.22,92.96 A17.N2 | A17.J2 93.22,105.66 93.22,100.71 A17.L2 | A17.C2 96.39,121.54 94.87,120.02 94.87,114.17 94.11,113.41 A17.F2 | A16.N2 105.92,92.96 105.92,88.01 A16.R2 106.81,86.61 107.57,85.85 107.57,80.01 109.09,78.49 A16.U2 | A16.C2 109.09,121.54 107.57,120.02 107.57,114.17 106.81,113.41 A16.F2 | A02.A1 293.24,127.89 293.24,122.94 A02.C1 | A06.A1 242.44,127.89 242.44,122.94 A06.C1 | A05.A1 255.14,127.89 255.14,122.94 A05.C1 | A04.A1 267.84,127.89 267.84,122.94 A04.C1
  Bottom 0.381: A03.A1 280.54,127.89 280.54,122.94 A03.C1 | 244.35,109.22 244.35,110.74 245.62,112.01 A05.F2 | 244.35,109.22 244.35,108.33 242.95,106.93 242.95,103.89 A06.K1 | v236.98,80.39 236.98,78.49 A06.U2 | A06.R2 233.17,88.01 233.17,92.96 A06.N2 232.92,94.36 232.92,99.31 A06.L2 232.92,100.71 232.92,105.66 A06.J2 232.92,107.06 232.92,112.01 A06.F2 | A05.R2 245.62,88.01 245.62,92.96 A05.N2 246.13,94.36 246.13,99.31 A05.L2 245.62,100.71 245.62,105.66 A05.J2 246.13,107.06 246.13,109.22 244.47,109.22 244.35,109.22 | A06.T1 239.52,81.66 239.52,86.61 A06.R1 | v249.56,80.39 249.56,78.49 A05.U2 | A05.T1 251.97,81.66 251.97,86.61 A05.R1 251.97,88.01 251.97,92.96 A05.N1 | A04.R2 258.32,88.01 258.32,92.96 A04.N2 258.32,94.36 258.32,99.31 A04.L2 258.32,100.71 258.32,105.66 A04.J2 258.32,107.06 258.32,112.01 A04.F2 | A04.T1 264.67,81.66 264.67,86.61 A04.R1 264.67,88.01 264.67,92.96 A04.N1 | A03.R2 271.14,88.01 271.14,92.96 A03.N2 271.02,94.36 271.02,99.31 A03.L2 271.02,100.71 271.02,105.66 A03.J2 271.14,107.06 271.14,112.01 A03.F2 | v268.73,101.09 268.73,102.49 A04.K1 | A03.T1 277.37,81.66 277.37,86.61 A03.R1 277.37,88.01 277.37,92.96 A03.N1 | A02.N2 283.72,92.96 283.72,88.01 A02.R2 | A02.L2 283.72,100.71 283.72,101.73 v282.83,102.62 283.08,103 283.08,105.03 283.72,105.66 A02.J2 283.72,107.06 283.72,112.01 A02.F2 | A02.T1 290.07,81.66 290.07,86.61 A02.R1 290.07,88.01 290.07,92.96 A02.N1 | A01.R2 296.42,88.01 296.42,92.96 A01.N2 296.42,94.36 296.42,99.31 A01.L2 296.42,100.71 296.42,105.66 A01.J2 296.42,107.06 296.42,112.01 A01.F2 | A15.R2 118.62,88.01 118.62,92.96 A15.N2 118.62,94.36 118.62,99.31 A15.L2
  Bottom 0.381: A15.J2 118.62,107.06 118.62,112.01 A15.F2 119.51,113.41 119.51,115.44 120.27,116.2 120.27,117.09 | 120.27,117.09 120.27,120.02 121.79,121.54 A15.C2 | A14.R2 131.32,88.01 131.32,92.96 A14.N2 131.32,94.36 131.32,99.31 A14.L2 131.57,100.71 131.57,105.66 A14.J2 131.32,107.06 131.32,112.01 A14.F2 132.21,113.41 132.97,114.17 132.97,117.09 | 132.97,117.09 132.97,120.02 134.49,121.54 A14.C2 | 120.27,117.09 120.4,117.09 132.84,117.09 132.97,117.09 | A13.U2 147.19,78.49 145.67,80.01 145.67,85.85 144.91,86.61 A13.R2 144.27,88.01 144.27,92.96 A13.N2 144.02,94.36 144.02,99.31 A13.L2 144.02,100.71 144.02,105.66 A13.J2 144.02,107.06 144.02,112.01 A13.F2 144.91,113.41 145.67,114.17 145.67,120.02 147.19,121.54 A13.C2 | B01.T1 302.77,11.81 302.77,16.76 B01.R1 302.77,18.16 302.77,23.11 B01.N1 303.66,24.51 304.42,25.27 304.42,31.11 305.94,32.64 B01.K1 | B02.T1 290.07,11.81 290.07,16.76 B02.R1 290.07,18.16 290.07,23.11 B02.N1 | B01.R2 296.42,18.16 296.42,23.11 B01.N2 296.42,24.51 296.42,29.46 B01.L2 296.42,30.86 296.42,35.81 B01.J2 296.42,37.21 296.42,42.16 B01.F2 | B05.U2 249.94,7.49 250.19,7.49 250.57,7.11 251.84,7.11 251.84,10.54 B05.T1 251.97,11.81 251.97,16.76 B05.R1 252.48,18.16 252.48,23.11 B05.N1 | B04.R2 258.32,18.16 258.32,23.11 B04.N2 258.32,24.51 258.32,29.46 B04.L2 258.7,30.86 258.7,32.64 258.06,33.27 v257.81,33.66 258.32,34.16 258.32,35.81 B04.J2 258.32,37.21 258.32,42.16 B04.F2 | v241.68,16.51 241.68,13.34 240.16,11.81 B06.T1 | B05.R2 245.62,18.16 245.62,23.11 B05.N2 245.62,24.51 245.62,29.46 B05.L2 245.62,30.86 245.62,35.81 B05.J2 245.62,37.21 245.62,42.16 B05.F2
  Bottom 0.381: B04.U2 262.64,8.38 264.67,10.41 B04.T1 265.18,11.81 265.18,16.76 B04.R1 264.67,18.16 264.67,23.11 B04.N1 | B03.R2 271.02,18.16 271.02,23.11 B03.N2 271.02,24.51 271.02,29.46 B03.L2 271.02,30.86 271.02,35.81 B03.J2 271.02,37.21 271.02,42.16 B03.F2 | B03.T1 277.37,11.81 277.37,16.76 B03.R1 277.37,18.16 277.37,23.11 B03.N1 278.26,24.51 278.26,24.64 279.78,26.16 279.78,31.88 280.54,32.64 B03.K1 | B02.R2 283.72,18.16 283.72,23.11 B02.N2 283.72,24.51 283.72,29.46 B02.L2 283.72,30.86 283.72,35.81 B02.J2 283.72,37.21 283.72,42.16 B02.F2 | B16.T2 106.81,10.41 108.84,8.38 B16.U2 | B18.T2 81.41,10.41 83.44,8.38 B18.U2 | B17.T2 94.11,10.41 96.14,8.38 B17.U2 | B19.V2 68.96,5.21 70.99,7.24 B19.U2 | B05.A1 255.14,58.04 255.14,53.09 B05.C1 | B04.A1 267.84,58.04 267.84,53.09 B04.C1 268.35,51.69 268.35,50.55 267.08,49.28 267.08,43.81 v267.33,43.56 | B03.A1 280.54,58.04 280.54,53.09 B03.C1 | B02.A1 293.24,58.04 293.24,53.09 B02.C1 | v224.28,10.54 224.28,8.64 B07.U2 | B07.R2 220.22,18.16 220.22,23.11 B07.N2 220.22,24.51 220.22,29.46 B07.L2 220.22,30.86 220.22,32.38 | 220.22,32.38 220.22,35.81 B07.J2 220.47,37.21 220.47,42.16 B07.F2 | B07.N1 227.08,23.11 227.08,18.16 B07.R1 226.57,16.76 226.57,11.81 B07.T1 | 220.22,32.38 v220.34,32.38 | B07.A1 229.74,58.04 229.74,53.09 B07.C1 230.25,51.69 230.25,48.01 v230.12,47.88 | v227.84,47.62 227.84,43.94 227.46,43.56 B07.F1 | v25.02,51.05 25.02,35.94 19.43,30.35 19.43,13.34 17.91,11.81 B23.T2
I_3CYCLE  (via drill 0.61)
  Top 0.152: v196.85,109.47 201.68,104.65 v234.7,104.65 | v236.98,100.71 237.36,101.09 248.54,101.09 v248.92,100.71
  Bottom 0.152: v196.85,109.47 196.85,114.17 194.18,116.84 194.18,131.06 78.61,131.06 64.01,116.46 64.01,83.57 64.26,83.31 64.26,80.64 64.01,80.39 64.01,49.15 66.17,46.99 66.17,45.21 67.82,43.56 B19.F2 | v234.7,104.65 235.46,103.89 235.46,102.23 v236.98,100.71 | A05.K2 248.92,102.49 v248.92,100.71 249.17,100.33 250.32,99.19 250.32,77.22 249.81,76.71 249.81,61.09 250.32,60.58 250.32,34.67 249.68,34.04 B05.K2
I_AC00  (via drill 0.61)
  Top 0.152: v107.95,52.45 109.09,53.59 v184.02,53.59 | v186.82,56.39 187.45,57.02 222.5,57.02 225.17,54.36 231.14,54.36 232.28,53.21 235.71,53.21 235.97,53.47 245.49,53.47 245.75,53.21 248.41,53.21 249.68,54.48 276.48,54.48 277.11,55.12 B03.B1 | v267.59,69.98 267.84,69.72 v277.5,69.72
  Bottom 0.152: v107.95,52.45 107.95,51.05 106.81,49.91 B16.D2 | v186.82,56.39 v184.02,53.59 | v267.59,69.98 267.21,70.36 267.21,131.7 273.18,131.7 275.72,129.16 275.72,127.76 277.37,126.11 A03.B1 | v277.5,69.72 277.5,56.26 B03.B1
I_AC01  (via drill 0.61)
  Top 0.152: v67.44,129.92 v110.62,86.74 | v63.12,132.08 63.63,132.59 267.59,132.59 v269.24,130.94
  Bottom 0.152: v110.62,86.74 110.62,51.82 107.44,48.64 107.44,44.2 106.81,43.56 B16.F2 | v67.44,129.92 64.77,132.59 63.12,132.59 v63.12,132.08 | v269.24,130.94 277.37,122.81 277.37,119.76 A03.D1 277.37,118.36 277.37,114.3 276.73,113.67 276.73,50.55 277.37,49.91 B03.D1
I_AC02  (via drill 0.61)
  Top 0.152: v148.59,41.02 121.16,41.02 121.16,38.99 119.76,37.59 107.7,37.59 107.06,36.96 B16.J2 | v171.45,128.65 172.47,129.67 184.15,129.67 184.28,129.54 185.04,129.54 185.42,129.92 v213.74,129.92 | v289.31,47.12 282.32,47.12 281.69,46.48 B03.E1 | v269.37,17.91 268.73,18.54 243.46,18.54 242.95,18.03 240.79,18.03 240.16,18.67 235.2,18.67 v234.95,18.41 | v232.03,21.46 231.01,22.48 v224.28,22.48 | v181.23,18.41 181.1,18.54 v154.43,18.54
  Bottom 0.152: v171.45,128.65 149.1,106.3 149.1,41.53 v148.59,41.02 148.84,40.64 148.84,24.13 v154.43,18.54 | v213.74,129.92 215.65,131.83 219.71,131.83 219.71,131.06 223.27,127.51 226.95,127.51 226.95,128.14 231.27,132.46 279.91,132.46 279.91,117.22 280.54,116.59 A03.E1 | v289.31,47.12 288.93,46.74 288.93,7.87 282.7,1.65 269.37,1.65 v269.37,17.91 | v234.95,18.41 232.03,21.34 v232.03,21.46 | v224.28,22.48 222.76,22.48 222.76,5.21 219.07,1.52 189.99,1.52 189.99,6.35 181.23,15.11 v181.23,18.41
I_AC03  (via drill 0.61)
  Top 0.152: v123.44,30.73 122.05,30.73 121.16,31.62 109.09,31.62 108.97,31.5 107.95,31.5 107.06,30.61 B16.L2 | v131.32,67.82 210.06,67.82 v210.19,67.94 | v212.22,64.52 242.44,64.52 243.21,63.75 270.13,63.75 270.51,64.14 v280.16,64.14
  Bottom 0.152: v123.44,30.73 126.75,34.04 126.75,63.25 v131.32,67.82 | v210.19,67.94 212.22,65.91 v212.22,64.52 | B03.H1 280.54,40.39 279.91,41.02 279.91,63.88 v280.16,64.14 279.91,64.52 279.91,108.2 280.54,108.84 A03.H1
I_AC04  (via drill 0.61)
  Top 0.152: v203.96,23.11 203.58,22.73 201.04,22.73 200.91,22.86 196.34,22.86 196.22,22.73 194.69,22.73 192.41,25.02 107.82,25.02 107.06,24.26 B16.N2 | v206.88,15.75 207.01,15.88 212.09,15.88 | 212.09,15.88 228.85,15.88 v230.5,17.53 | v238.76,2.29 239.52,1.52 256.92,1.52 258.19,2.79 272.29,2.79 v274.7,5.21 | v242.06,105.41 242.44,105.03 276.23,105.03 277.11,105.92 A03.J1 | v238.89,66.17 238.25,66.8 213.36,66.8 v212.98,66.42 | 212.09,15.88 v212.09,15.75
  Bottom 0.152: v203.96,23.11 206.88,20.19 v206.88,15.75 | v230.5,17.53 230.76,17.27 230.76,15.88 234.95,11.68 234.95,6.1 v238.76,2.29 | v274.7,5.21 276.73,7.24 276.73,35.18 277.37,35.81 B03.J1 | v242.06,105.41 240.79,104.14 240.79,96.39 238.63,94.23 238.63,90.04 240.79,87.88 240.79,68.96 238.89,67.06 v238.89,66.17 | v212.98,66.42 212.98,56.39 212.72,56.13 212.72,30.23 212.09,29.59 212.09,27.69 212.22,27.56 212.22,15.88 v212.09,15.75
I_AC05  (via drill 0.61)
  Top 0.152: v132.08,70.1 132.46,69.72 157.86,69.72 158.24,69.34 191.13,69.34 191.64,69.85 v199.14,69.85 | v201.04,76.83 201.17,76.71 211.71,76.71 v213.23,78.23 | v213.49,85.85 213.87,86.23 221.62,86.23 222.12,86.74 v223.39,86.74 | v227.33,72.14 276.99,72.14 v277.62,72.77
  Bottom 0.152: v132.08,70.1 132.08,64.52 132.84,63.75 132.84,54.99 130.68,52.83 130.68,22.73 116.33,22.73 111.63,18.03 111.63,17.91 107.06,17.91 B16.R2 | v199.14,69.85 199.26,69.98 199.26,75.06 v201.04,76.83 | v213.23,78.23 213.23,85.6 v213.49,85.85 | v223.39,86.74 226.19,83.95 226.19,81.79 225.93,81.53 225.93,73.53 v227.33,72.14 | 278.26,73.41 278.89,74.04 278.89,98.68 278.26,99.31 A03.L1 | v277.62,72.77 278.26,73.41 | 278.26,73.41 278.26,69.34 277.88,68.96 277.88,58.55 278.89,57.53 278.89,31.5 278.26,30.86 B03.L1
I_AC06  (via drill 0.61)
  Top 0.152: v273.05,2.41 272.8,2.16 258.06,2.16 257.05,1.14 238.63,1.14 v237.49,2.29 | v231.78,8 230.76,9.02 215.52,9.02 v213.87,7.37 | v210.57,4.06 209.17,2.67 116.33,2.67 v114.3,4.7 | v271.4,130.18 248.67,130.18 247.4,131.44 216.41,131.44 v216.03,131.06 | v216.79,24.26 216.79,22.86 v215.9,22.86
  Bottom 0.152: v273.05,2.41 278.89,8.26 278.89,24.64 280.54,26.29 B03.M1 | v237.49,2.29 v231.78,8 | 213.23,6.73 v210.57,4.06 | v213.87,7.37 213.23,6.73 | v114.3,4.7 113.79,5.21 113.79,5.84 94.87,24.77 94.87,47.75 94.11,48.51 B17.D2 | v271.4,130.18 278.89,122.68 278.89,116.33 282.07,113.16 282.07,98.17 281.43,97.54 A03.M1 | v216.03,131.06 216.03,25.02 v216.79,24.26 | v215.9,22.86 213.23,20.19 213.23,6.73
I_AC07  (via drill 0.61)
  Top 0.152: v119.38,38.35 102.74,38.35 100.33,40.77 96.01,40.77 94.36,42.42 B17.F2 | v122.43,31.5 122.68,31.75 194.18,31.75 v194.56,32.13 | v196.85,26.92 197.87,25.91 239.14,25.91 v239.4,26.16 | v243.46,16.64 243.71,16.38 252.98,16.38 253.11,16.51 258.06,16.51 258.19,16.38 275.08,16.38 278.89,20.19 280.29,20.19 B03.P1
  Bottom 0.152: v119.38,38.35 121.16,36.58 121.16,32.77 v122.43,31.5 | v194.56,32.13 194.18,31.75 194.18,29.59 v196.85,26.92 | v239.4,26.16 241.81,23.75 241.81,18.29 v243.46,16.64 | A03.P1 281.43,89.79 282.07,89.15 282.07,21.97 281.43,21.34 B03.P1
I_AC08  (via drill 0.61)
  Top 0.152: v282.83,83.31 282.45,83.69 281.69,83.69 A03.S1 | v97.16,35.69 94.74,35.69 94.36,36.07 B17.J2 | v116.33,3.81 116.71,3.43 186.56,3.43 186.94,3.05 208.41,3.05 211.2,5.84 231.27,5.84 231.65,5.46 232.41,5.46 232.92,5.97 278.89,5.97 v279.02,5.84
  Bottom 0.152: v282.83,83.31 282.7,83.19 282.7,16.26 281.43,14.99 B03.S1 280.54,13.59 279.91,12.95 279.91,6.73 v279.02,5.84 | v97.16,35.69 98.3,34.54 98.3,21.84 v116.33,3.81
I_AC09  (via drill 0.61)
  Top 0.152: v149.73,33.78 148.21,32.26 109.22,32.26 108.84,31.88 95.63,31.88 94.36,30.61 B17.L2 | v151.89,45.59 153.42,47.12 182.12,47.12 182.88,46.35 184.4,46.35 185.29,47.24 v202.56,47.24 | v202.95,51.69 203.33,51.31 208.41,51.31 210.69,53.59 v227.58,53.59 | v228.09,88.52 228.22,88.39 v259.97,88.39 | v260.1,92.33 260.35,92.58 v267.97,92.58 | v271.78,52.83 272.42,53.47 290.19,53.47 290.45,53.21 291.21,53.21 296.67,58.67 296.67,65.02 v269.37,65.02
  Bottom 0.152: v149.73,33.78 151.89,35.94 v151.89,45.59 | v202.56,47.24 202.95,47.62 v202.95,51.69 | v227.58,53.59 228.47,54.48 228.47,88.14 v228.09,88.52 | v259.97,88.39 260.1,88.52 v260.1,92.33 | 269.37,93.98 269.49,94.11 269.49,116.84 271.02,118.36 A03.D2 | v267.97,92.58 269.37,93.98 | v271.78,52.83 271.78,49.91 B03.D2 | v269.37,65.02 269.75,65.41 269.75,90.17 269.37,90.55 269.37,93.98
I_AC10  (via drill 0.61)
  Top 0.152: v188.09,27.69 185.8,25.4 95.5,25.4 94.36,24.26 B17.N2 | v209.68,127.25 209.93,127.51 211.71,127.51 212.22,128.02 216.41,128.02 216.92,127.51 227.46,127.51 v227.71,127.76 | v266.32,116.2 267.72,114.81 273.3,114.81 273.94,115.44 A03.E2
  Bottom 0.152: v188.09,27.69 190.37,29.97 190.37,84.58 189.99,84.96 189.99,86.23 193.17,89.41 193.17,94.36 195.45,96.65 197.36,96.65 197.36,96.27 197.87,95.76 200.03,95.76 200.03,115.82 209.68,125.48 v209.68,127.25 | v227.71,127.76 232.03,132.08 266.32,132.08 v266.32,116.2 | B03.E2 275.08,46.74 275.84,47.5 275.84,113.79 275.08,114.55 275.08,115.19 A03.E2
I_AC11  (via drill 0.61)
  Top 0.152: v121.16,24.26 116.46,19.56 96.01,19.56 94.36,17.91 B17.R2 | v130.18,55.63 131.19,56.64 v165.74,56.64 | v167,70.87 168.66,72.52 204.85,72.52 205.61,71.75 219.46,71.75 v219.84,71.37 | v221.74,51.56 222,51.31 225.17,51.31 225.55,51.69 229.24,51.69 229.62,51.31 238.76,51.31 239.14,51.69 240.54,51.69 241.94,50.29 266.95,50.29 267.08,50.16 270.76,50.16 270.89,50.29 v273.69,50.29
  Bottom 0.152: v121.16,24.26 127.13,30.23 127.13,52.58 v130.18,55.63 | v165.74,56.64 165.61,56.77 165.61,69.47 v167,70.87 | v219.84,71.37 221.74,69.47 v221.74,51.56 | B03.H2 274.19,40.39 273.56,41.02 273.56,50.16 v273.69,50.29 273.56,50.67 273.56,108.2 274.19,108.84 A03.H2
I_ACCEPT  (via drill 0.61)
  Top 0.152: v134.62,35.69 132.72,37.59 122.68,37.59 122.68,38.99 B15.H2 | v143.38,21.34 145.41,19.3 184.91,19.3 185.17,19.05 220.73,19.05 v221.11,19.43 | v222,15.11 222.38,14.73 223.14,14.73 B07.S2 | v257.81,13.97 261.24,13.97 B04.S2 | v256.54,2.29 256.29,2.03 240.28,2.03 v240.03,2.29 | v235.97,10.16 235.59,9.78 219.71,9.78 v219.33,10.16 | v260.1,84.58 261.24,84.58 A04.S2 | v259.59,78.87 246.25,78.87 v244.6,77.22 | v243.71,55.88 242.32,54.48 237.49,54.48 v237.24,54.74
  Bottom 0.152: v134.62,35.69 143.38,26.92 v143.38,21.34 | v221.11,19.43 222,18.54 v222,15.11 221.74,14.73 219.58,12.57 219.58,10.41 v219.33,10.16 | v257.81,13.97 257.43,13.59 257.43,11.94 257.05,11.56 257.05,2.79 v256.54,2.29 | v240.03,2.29 237.62,4.7 237.62,8.51 v235.97,10.16 235.71,10.54 235.46,10.79 235.46,14.86 235.71,15.11 235.71,18.8 234.57,19.94 234.57,36.96 233.3,38.23 233.3,41.27 232.28,42.29 232.28,49.78 v237.24,54.74 | v260.1,84.58 259.33,83.82 259.33,82.04 259.84,81.53 259.84,79.12 v259.59,78.87 | v244.6,77.22 244.47,77.09 244.47,56.64 v243.71,55.88
I_ACCLR  (via drill 0.61)
  Top 0.152: v175.51,34.16 175.13,34.54 79.12,34.54 79.12,35.69 79.5,36.07 80.26,36.07 B18.J2 | v177.55,62.87 189.99,62.87 191.52,64.39 200.91,64.39 203.71,67.18 239.01,67.18 240.28,65.91 278.64,65.91 | 278.64,65.91 v295.66,65.91 | v296.29,78.74 297.94,80.39 297.94,89.41 275.97,89.41 275.34,90.04 A03.P2 | v277.5,25.4 v275.08,22.99 | 278.64,65.91 v278.64,65.79
  Bottom 0.152: v175.51,34.16 177.55,36.2 v177.55,62.87 | v295.66,65.91 295.66,76.58 296.29,77.22 v296.29,78.74 | v275.08,22.99 275.08,21.34 B03.P2 | v277.5,25.4 279.27,27.18 279.27,57.66 278.38,58.55 278.38,65.53 v278.64,65.79
I_ADD00  (via drill 0.61)
  Top 0.152: v108.33,48.39 108.08,48.13 92.2,48.13 90.04,50.29 56.9,50.29 56.26,49.66 B20.D2 | v120.78,29.08 166.12,29.08 168.4,31.37 200.03,31.37 201.04,32.38 v201.55,32.38 | v226.82,34.67 v203.84,34.67 | v228.09,41.53 230.25,43.69 v231.01,43.69 | v231.14,55.12 232.66,56.64 235.33,56.64 | 235.33,56.64 263.78,56.64 264.41,56.01 B04.B1 | v254.25,108.58 254,108.33 v245.24,108.33 | v244.73,102.23 244.6,102.11 234.82,102.11 v234.7,102.23 | 235.33,56.64 v235.33,56.26
  Bottom 0.152: v108.33,48.39 107.82,47.88 107.82,31.37 110.11,29.08 v120.78,29.08 | v203.84,34.67 v201.55,32.38 | v226.82,34.67 228.09,35.94 v228.09,41.53 | v231.01,43.69 231.27,43.94 231.27,54.99 v231.14,55.12 | v254.25,108.58 254.25,109.86 256.67,112.27 256.67,128.02 258.95,128.02 260.35,126.62 260.35,125.86 264.41,125.86 A04.B1 | v245.24,108.33 244.73,107.82 v244.73,102.23 | v234.7,102.23 235.2,101.73 235.2,56.39 v235.33,56.26
I_ADD01  (via drill 0.61)
  Top 0.152: v58.67,43.18 56.26,43.18 B20.F2 | v63.25,110.49 73.91,121.16 v75.06,121.16 | v152.65,126.49 155.83,123.32 228.47,123.32 v228.73,123.06 | v231.39,125.73 232.16,126.49 241.81,126.49 v243.33,124.97 | v246.51,121.41 247.01,120.9 263.02,120.9 264.41,119.51 A04.D1
  Bottom 0.152: v58.67,43.18 60.83,45.34 60.83,66.42 61.09,66.67 61.09,73.79 60.83,74.04 60.83,108.08 v63.25,110.49 | v75.06,121.16 80.39,126.49 v152.65,126.49 | v228.73,123.06 v231.39,125.73 | v243.33,124.97 246.51,121.79 v246.51,121.41 | B04.D1 264.67,49.91 264.54,50.04 264.54,54.48 264.03,54.99 264.03,117.73 264.67,118.36 A04.D1
I_ADD02  (via drill 0.61)
  Top 0.152: v64.39,131.83 64.77,132.21 266.7,132.21 v267.97,130.94 | v265.43,45.97 267.59,45.97 B04.E1 | v263.78,39.88 262.51,38.61 v235.33,38.61 | v234.44,44.07 234.06,44.45 v223.77,44.45 | v222.5,54.36 222.12,53.98 205.49,53.98 204.98,53.47 v202.95,53.47 | v201.17,66.55 200.66,67.06 v60.33,67.06
  Bottom 0.152: 60.2,67.06 60.45,67.31 60.45,127.89 v64.39,131.83 | 60.2,67.06 57.66,64.52 57.66,38.86 56.01,37.21 B20.J2 | v267.97,130.94 269.37,129.54 269.37,117.22 268.73,116.59 A04.E1 | v265.43,45.97 263.78,45.97 v263.78,39.88 | v235.33,38.61 234.44,39.5 v234.44,44.07 | v223.77,44.45 222.5,45.72 v222.5,54.36 | v202.95,53.47 202.69,53.72 202.69,57.78 201.17,59.31 v201.17,66.55 | v60.33,67.06 60.2,67.06
I_ADD03  (via drill 0.61)
  Top 0.152: v78.99,36.96 71.12,29.08 56.9,29.08 56.26,29.72 B20.L2 | v81.53,61.34 81.92,61.72 192.53,61.72 194.56,63.75 v202.82,63.75 | v206.76,88.52 226.95,88.52 227.71,89.28 268.73,89.28 v270.26,90.81 | v270.26,109.22 268.99,109.22 A04.H1 | v267.33,36.96 265.81,35.43 262.38,35.43 v262.25,35.56 | v260.99,24.64 260.73,24.89 257.56,24.89 v255.91,23.24 | v225.81,19.43 225.68,19.56 222.63,19.56 220.47,21.72 v208.66,21.72 | v207.14,65.66 v204.09,65.66
  Bottom 0.152: v78.99,36.96 79.5,37.47 79.5,45.09 79.88,45.47 79.88,59.69 v81.53,61.34 | v202.82,63.75 203.71,64.64 203.71,65.66 | 203.71,65.66 203.71,85.47 v206.76,88.52 | v270.26,90.81 v270.26,109.22 | v267.33,36.96 267.33,38.48 267.84,38.99 B04.H1 | v262.25,35.56 260.86,34.16 260.86,24.77 v260.99,24.64 | v255.91,23.24 253.49,20.83 253.49,16.89 252.73,16.13 252.73,12.45 253.49,11.68 253.49,4.19 250.44,1.14 226.31,1.14 226.31,3.81 225.55,4.57 225.55,19.18 v225.81,19.43 | v208.66,21.72 209.04,22.1 209.04,43.56 206.76,45.85 206.76,61.98 207.14,62.36 v207.14,65.66 | v204.09,65.66 203.71,65.66
I_ADD04  (via drill 0.61)
  Top 0.152: v69.22,8.51 75.44,2.29 v218.69,2.29 223.39,2.29 223.77,1.91 224.54,1.91 225.68,3.05 v247.14,3.05 | v247.9,29.21 248.28,28.83 263.4,28.83 v263.78,29.21 | v264.8,101.6 264.41,101.22 249.56,101.22 249.3,101.47 233.17,101.47 v231.27,99.57 | v231.27,79.63 230.5,78.87 223.14,78.87 v218.31,74.04
  Bottom 0.152: v69.22,8.51 57.66,20.07 57.66,21.46 56.01,23.11 B20.N2 | v247.14,3.05 247.52,3.43 247.52,28.83 v247.9,29.21 | v263.78,29.21 264.03,29.46 264.03,35.18 264.67,35.81 B04.J1 | v264.8,101.6 264.8,105.66 A04.J1 | v231.27,79.63 v231.27,99.57 | v218.31,74.04 218.69,73.66 218.69,21.72 218.95,21.46 218.95,10.92 218.57,10.54 218.57,4.32 218.69,4.19 v218.69,2.29
I_ADD05  (via drill 0.61)
  Top 0.152: v59.05,67.06 62.87,70.87 165.35,70.87 166.5,69.72 185.55,69.72 v185.93,70.1 | v189.23,66.29 189.61,65.91 v197.87,65.91 | v200.53,46.48 203.58,46.48 204.22,47.12 227.2,47.12 227.46,46.86 229.36,46.86 229.62,47.12 240.28,47.12 240.41,47.24 262.38,47.24 v264.54,45.09
  Bottom 0.152: v59.05,67.06 53.59,61.59 53.59,19.68 55.12,18.16 B20.R2 | v185.93,70.1 189.23,66.8 v189.23,66.29 | v197.87,65.91 200.53,63.25 v200.53,46.48 | v264.54,45.09 266.19,43.43 | 266.19,43.43 266.19,31.5 265.56,30.86 B04.L1 | 266.19,43.43 266.19,94.23 265.68,94.74 265.68,99.19 265.56,99.31 A04.L1
I_ADD06  (via drill 0.61)
  Top 0.152: v54.36,50.29 44.2,50.29 43.56,49.66 B21.D2 | v120.27,56.64 v56.77,56.64 | v123.57,38.73 124.33,37.97 137.54,37.97 137.92,37.59 195.83,37.59 v198.25,35.18 | v199.77,30.61 200.79,31.62 226.44,31.62 v226.82,32 | v228.6,24.26 230,22.86 232.66,22.86 232.79,22.73 v235.59,22.73 | v237.24,23.37 238.12,22.48 262.13,22.48 266.19,26.54 267.59,26.54 B04.M1 | v268.61,94.36 268.99,94.74 293.12,94.74 301.12,86.74 301.12,79.25 299.85,79.25 298.32,77.72 298.32,72.26 292.74,72.26 290.07,69.6 v284.73,69.6 | v286,30.35 284.73,29.08 268.73,29.08 v268.61,29.21
  Bottom 0.152: v54.36,50.29 56.77,52.7 v56.77,56.64 | v120.27,56.64 123.57,53.34 v123.57,38.73 | v198.25,35.18 199.77,33.66 v199.77,30.61 | v226.82,32 228.47,30.35 228.47,24.38 v228.6,24.26 | v235.59,22.73 237.24,22.73 v237.24,23.37 | v268.61,94.36 268.61,96.14 A04.M1 | v284.73,69.6 284.35,69.22 284.35,57.53 285.62,56.26 285.62,30.73 v286,30.35 | v268.61,29.21 268.61,27.69 B04.M1
I_ADD07  (via drill 0.61)
  Top 0.152: v77.47,43.56 77.09,43.94 44.2,43.94 43.56,43.31 B21.F2 | v79.5,61.34 80.26,62.1 190.25,62.1 191.77,63.63 v191.9,63.63 | v193.17,68.96 193.29,69.09 200.28,69.09 201.8,70.61 218.44,70.61 219.58,69.47 265.94,69.47 267.46,70.99 v268.35,70.99
  Bottom 0.152: B04.P1 268.73,21.34 268.86,21.46 268.86,25.91 269.37,26.42 269.37,59.69 268.35,60.71 v268.35,70.99 268.35,76.2 269.37,77.22 269.37,89.15 268.73,89.79 A04.P1 | v77.47,43.56 79.5,45.59 v79.5,61.34 | v191.9,63.63 193.17,64.9 v193.17,68.96
I_ADD08  (via drill 0.61)
  Top 0.152: v45.21,36.96 43.56,36.96 B21.J2 | v47.37,59.69 48.26,60.58 85.09,60.58 85.85,61.34 192.66,61.34 193.17,61.85 v196.34,61.85 | v197.1,70.74 198.12,71.75 205.1,71.75 205.49,71.37 218.69,71.37 219.46,70.61 v224.03,70.61 | v225.17,72.26 225.81,72.9 v231.14,72.9 | v233.04,78.74 233.93,79.63 265.81,79.63 v267.97,81.79 | v263.02,32.13 262.89,32.26 258.7,32.26 258.19,32.77 256.67,32.77 255.91,32 240.92,32 238.51,34.42 234.19,34.42 v233.81,34.04
  Bottom 0.152: v45.21,36.96 47.37,39.12 v47.37,59.69 | v196.34,61.85 197.1,62.61 v197.1,70.74 | v224.03,70.61 225.17,71.75 v225.17,72.26 | 231.9,73.66 232.28,74.04 232.28,77.98 v233.04,78.74 | v231.14,72.9 231.9,73.66 | v267.97,81.79 267.97,83.44 A04.S1 | v263.02,32.13 263.02,28.83 266.57,25.27 266.57,16.26 267.84,14.99 B04.S1 | v233.81,34.04 232.03,35.81 232.03,42.04 231.9,42.16 231.9,73.66
I_ADD09  (via drill 0.61)
  Top 0.152: v99.44,33.78 97.92,32.26 81.41,32.26 75.06,25.91 58.17,25.91 56.01,28.07 45.21,28.07 43.56,29.72 B21.L2 | v109.98,98.93 122.43,111.38 188.09,111.38 188.47,111 226.95,111 v230,114.05 | v234.95,119.13 236.09,117.98 257.43,117.98 258.06,118.62 A04.D2
  Bottom 0.152: v99.44,33.78 102.23,36.58 102.23,38.99 102.11,39.12 102.11,97.41 103.63,98.93 v109.98,98.93 | v230,114.05 234.95,119 v234.95,119.13 | B04.D2 258.83,49.91 258.83,53.85 257.68,54.99 257.68,117.73 258.32,118.36 A04.D2
I_ADD10  (via drill 0.61)
  Top 0.152: v44.07,72.64 53.47,82.04 121.41,82.04 121.54,82.17 141.6,82.17 143.89,79.88 v172.47,79.88 | v178.31,99.44 180.21,101.35 v223.65,101.35 | v234.95,122.3 235.97,123.32 256.92,123.32 257.18,123.06 260.48,123.06 v260.73,123.32 | v259.08,46.48 261.24,46.48 B04.E2 | v258.06,51.44 258.19,51.31 262.89,51.31 263.4,51.82 266.57,51.82 v267.46,50.93 | v267.46,64.52 267.08,64.14 243.33,64.14 242.44,65.02 230.63,65.02 229.62,66.04 v227.71,66.04
  Bottom 0.152: v44.07,72.64 44.07,25.27 43.31,24.51 B21.N2 | v172.47,79.88 178.31,85.72 v178.31,99.44 | 224.92,102.62 228.85,106.55 228.85,116.2 v234.95,122.3 | v223.65,101.35 224.92,102.62 | v260.73,123.32 263.02,123.32 263.02,120.52 261.11,118.62 261.11,116.97 261.49,116.59 A04.E2 | v259.08,46.48 257.68,47.88 257.68,51.05 v258.06,51.44 | v267.46,50.93 267.21,51.18 267.21,64.26 v267.46,64.52 | v227.71,66.04 228.09,66.42 228.09,84.58 224.92,87.76 224.92,102.62
I_ADD11  (via drill 0.61)
  Top 0.152: v61.98,111.12 v48.13,97.28 | v212.6,127.25 212.98,126.87 258.19,126.87 v258.57,127.25
  Bottom 0.152: v48.13,97.28 48.13,72.01 44.45,68.33 44.45,19.3 43.31,18.16 B21.R2 | v61.98,111.12 63.63,112.78 63.63,116.59 78.49,131.44 210.06,131.44 210.06,128.02 210.82,127.25 v212.6,127.25 | v258.57,127.25 259.97,125.86 259.97,121.92 260.73,121.16 260.73,111 261.49,110.24 A04.H2 261.49,108.84 261.49,108.58 260.86,107.95 260.86,45.47 261.37,44.96 261.37,40.51 261.49,40.39 B04.H2
I_BAC00  (via drill 0.61)
  Top 0.152: v186.82,41.53 186.94,41.4 210.19,41.4 211.07,42.29 213.23,42.29 213.74,41.78 222.25,41.78 v222.5,42.04 | v225.17,55.5 226.31,55.5 B07.B1 227.71,56.01 228.73,57.02 238.51,57.02 v240.92,59.44 | B01.B1 302.77,56.26 302.77,66.93 v294.89,66.93 294.64,66.55 243.46,66.55 v243.33,66.67
  Bottom 0.152: v186.82,41.53 186.82,41.02 186.18,40.39 B10.H2 | v222.5,42.04 225.17,44.7 v225.17,55.5 | v294.89,66.93 295.27,67.31 295.27,76.71 295.53,76.96 295.53,121.03 299.47,124.97 302.51,124.97 A01.B1 | v240.92,59.44 243.33,61.85 v243.33,66.67
I_BAC01  (via drill 0.61)
  Top 0.152: v186.06,48.01 205.23,48.01 205.61,47.62 225.17,47.62 226.31,48.77 B07.D1 227.71,48.77 230.38,48.77 231.27,47.88 286.38,47.88 | 286.38,47.88 288.16,47.88 288.42,48.13 301.88,48.13 302.51,48.77 B01.D1 | v302.01,103.5 297.31,98.81 v286.26,98.81 | 286.38,47.88 v286.38,48.39
  Bottom 0.152: v186.06,48.01 181.23,43.18 181.23,25.4 182.12,24.51 B10.N2 | v302.01,103.5 302.01,117.6 302.77,118.36 A01.D1 | v286.26,98.81 285.88,98.42 285.88,56.52 286.26,56.13 286.26,48.51 v286.38,48.39
I_BAC02  (via drill 0.61)